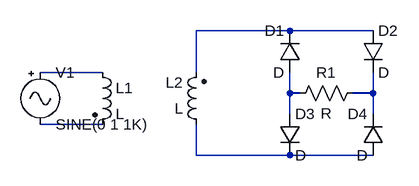
[diagram p0: schematic Bridge Transformer.asc]
Bridge Transformer.asc, the LTspice schematic file:
Version 4
SHEET 1 880 680
WIRE 256 64 112 64
WIRE 384 64 256 64
WIRE -32 128 -128 128
WIRE 112 128 112 64
WIRE 256 160 256 128
WIRE 272 160 256 160
WIRE 384 160 384 128
WIRE 384 160 352 160
WIRE 256 192 256 160
WIRE 384 192 384 160
WIRE -32 208 -128 208
WIRE 112 256 112 208
WIRE 256 256 112 256
WIRE 384 256 256 256
SYMBOL ind2 -48 112 R0
SYMATTR InstName L1
SYMBOL ind2 128 224 R180
WINDOW 0 36 80 Left 2
WINDOW 3 36 40 Left 2
SYMATTR InstName L2
SYMBOL diode 272 128 R180
WINDOW 0 24 64 Left 2
WINDOW 3 24 0 Left 2
SYMATTR InstName D1
SYMBOL diode 368 64 R0
SYMATTR InstName D2
SYMBOL diode 240 192 R0
SYMATTR InstName D3
SYMBOL diode 400 256 R180
WINDOW 0 24 64 Left 2
WINDOW 3 24 0 Left 2
SYMATTR InstName D4
SYMBOL res 256 176 R270
WINDOW 0 32 56 VTop 2
WINDOW 3 0 56 VBottom 2
SYMATTR InstName R1
SYMBOL Misc\\signal -128 112 R0
SYMATTR InstName V1

The netlist it stands for:
* Bridge Transformer.asc
L1 N002 N005 L
L2 N006 N001 L
D1 N003 N001 D
D2 N001 N004 D
D3 N003 N006 D
D4 N006 N004 D
R1 N003 N004 R
V1 N002 N005 SINE(0 1 1K)
.model D D
.lib standard.dio
.backanno
.end